# Altium schematic sheet System Control - Bank2.SchDoc
size C
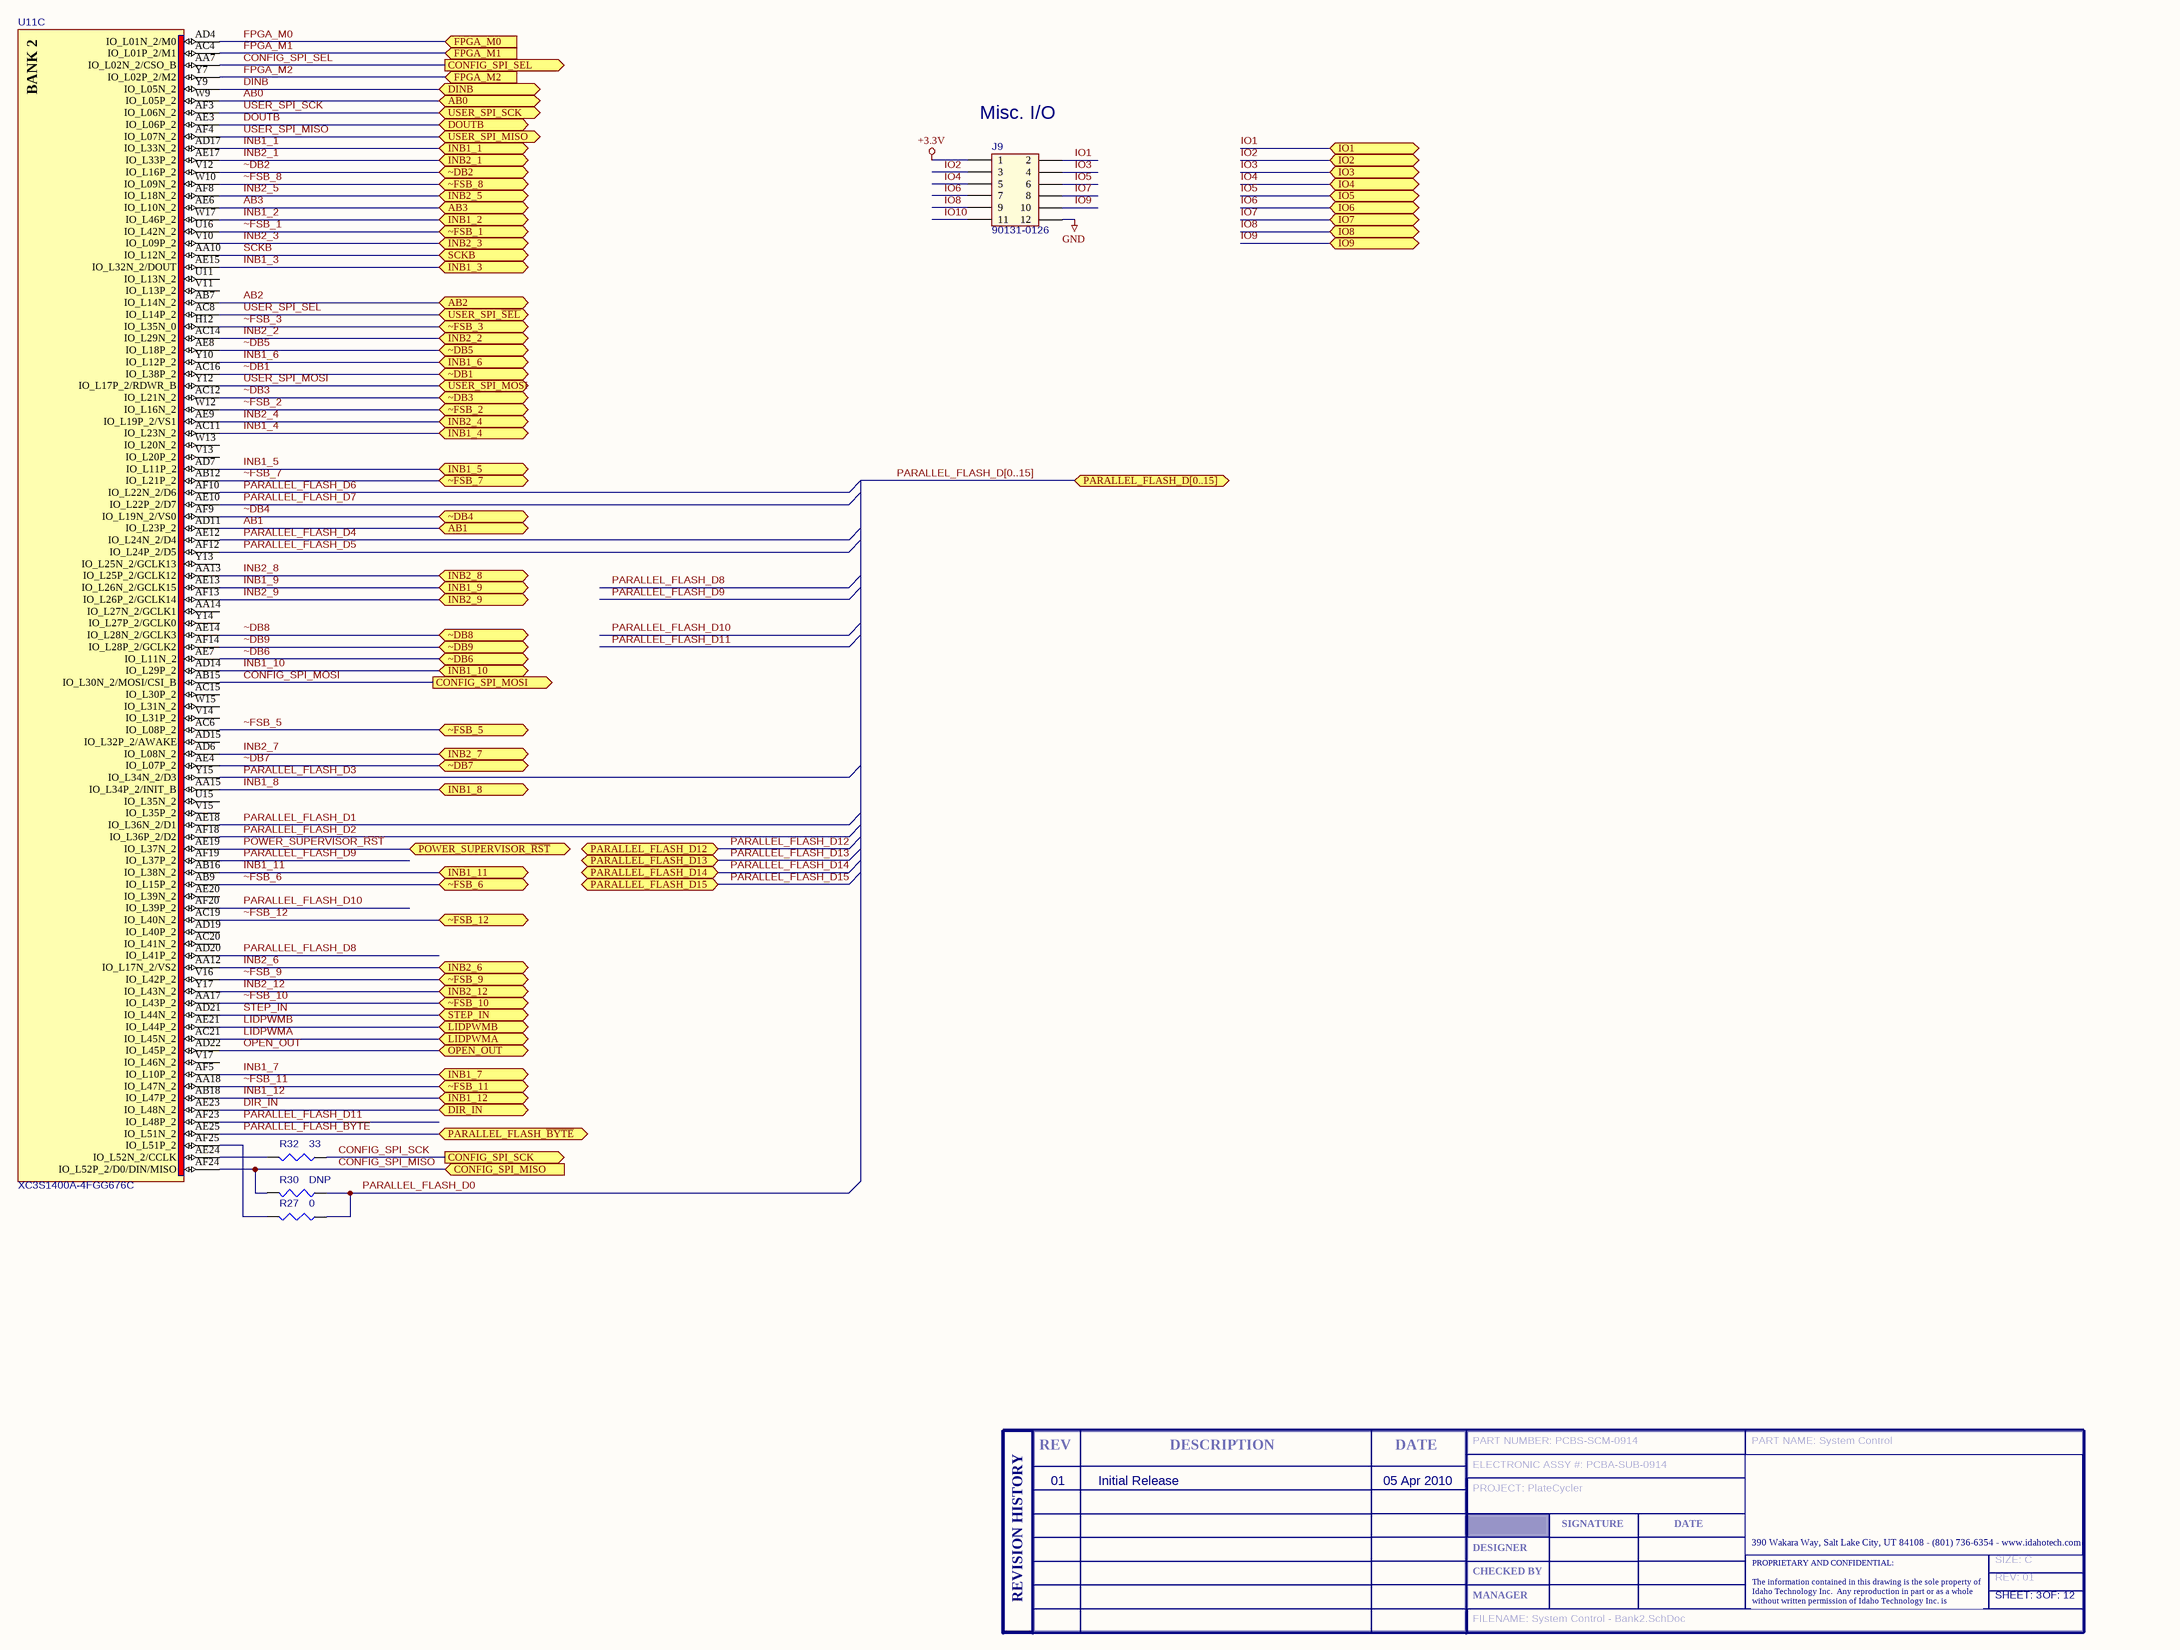
[diagram p0: System Control - Bank2.SchDoc]

## Parts
J9  Manufacturer P/N: 90131-0126  [HEADER_2X6_2]  (hidden comment: HEADER_2X6_1)
R27  0  [SM/R_0603]
R30  DNP  [SM/R_0603]  (no BOM)
R32  33  [SM/R_0603]
T?  SIZE: C  REV: 01  FILENAME: System Control - Bank2.SchDoc  PART NUMBER: PCBS-SCM-0914  PART NAME: System Control  ELECTRONIC ASSY #: PCBA-SUB-0914  PROJECT: PlateCycler  SHEET: 3  OF: 12  (hidden comment: ITI Title Block, A Size)  (graphical)
U11  XC3S1400A-4FGG676C  [FGG676]  (part C of 9)

## Ports
AB0, AB1, AB2, AB3, CONFIG_SPI_MISO (in), CONFIG_SPI_MOSI (out), CONFIG_SPI_SCK (out), CONFIG_SPI_SEL (out), DINB, DIR_IN, DOUTB, FPGA_M0 (in), FPGA_M1 (in), FPGA_M2 (in), INB1_1, INB1_2, INB1_3, INB1_4, INB1_5, INB1_6, INB1_7, INB1_8, INB1_9, INB1_10, INB1_11, INB1_12, INB2_1, INB2_2, INB2_3, INB2_4, INB2_5, INB2_6, INB2_7, INB2_8, INB2_9, INB2_12, IO1, IO2, IO3, IO4, IO5, IO6, IO7, IO8, IO9, LIDPWMA, LIDPWMB, OPEN_OUT, PARALLEL_FLASH_D12, PARALLEL_FLASH_D13, PARALLEL_FLASH_D14, PARALLEL_FLASH_D15, PARALLEL_FLASH_D[0..15] (bidir), PARALLEL_FLASH_~{BYTE}, POWER_SUPERVISOR_~{RST}, SCKB, STEP_IN, USER_SPI_MISO, USER_SPI_MOSI, USER_SPI_SCK, USER_SPI_~{SEL}, ~DB1, ~DB2, ~DB3, ~DB4, ~DB5, ~DB6, ~DB7, ~DB8, ~DB9, ~FSB_1, ~FSB_2, ~FSB_3, ~FSB_5, ~FSB_6, ~FSB_7, ~FSB_8, ~FSB_9, ~FSB_10, ~FSB_11, ~FSB_12

## Nets
+3.3V: J9.1
GND: J9.12
AB0: U11.W9(IO_L05P_2) ; port AB0
AB1: U11.AD11(IO_L23P_2) ; port AB1
AB2: U11.AB7(IO_L14N_2) ; port AB2
AB3: U11.AE6(IO_L10N_2) ; port AB3
CONFIG_SPI_MISO: R30.2 U11.AF24(IO_L52P_2/D0/DIN/MISO) ; port CONFIG_SPI_MISO
CONFIG_SPI_MOSI: U11.AB15(IO_L30N_2/MOSI/CSI_B) ; port CONFIG_SPI_MOSI
CONFIG_SPI_SCK: R32.1 ; port CONFIG_SPI_SCK
CONFIG_SPI_SEL: U11.AA7(IO_L02N_2/CSO_B) ; port CONFIG_SPI_SEL
DINB: U11.Y9(IO_L05N_2) ; port DINB
DIR_IN: U11.AE23(IO_L48N_2) ; port DIR_IN
DOUTB: U11.AE3(IO_L06P_2) ; port DOUTB
FPGA_M0: U11.AD4(IO_L01N_2/M0) ; port FPGA_M0
FPGA_M1: U11.AC4(IO_L01P_2/M1) ; port FPGA_M1
FPGA_M2: U11.Y7(IO_L02P_2/M2) ; port FPGA_M2
INB1_1: U11.AD17(IO_L33N_2) ; port INB1_1
INB1_2: U11.W17(IO_L46P_2) ; port INB1_2
INB1_3: U11.AE15(IO_L32N_2/DOUT) ; port INB1_3
INB1_4: U11.AC11(IO_L23N_2) ; port INB1_4
INB1_5: U11.AD7(IO_L11P_2) ; port INB1_5
INB1_6: U11.Y10(IO_L12P_2) ; port INB1_6
INB1_7: U11.AF5(IO_L10P_2) ; port INB1_7
INB1_8: U11.AA15(IO_L34P_2/INIT_B) ; port INB1_8
INB1_9: U11.AE13(IO_L26N_2/GCLK15) ; port INB1_9
INB1_10: U11.AD14(IO_L29P_2) ; port INB1_10
INB1_11: U11.AB16(IO_L38N_2) ; port INB1_11
INB1_12: U11.AB18(IO_L47P_2) ; port INB1_12
INB2_1: U11.AE17(IO_L33P_2) ; port INB2_1
INB2_2: U11.AC14(IO_L29N_2) ; port INB2_2
INB2_3: U11.V10(IO_L09P_2) ; port INB2_3
INB2_4: U11.AE9(IO_L19P_2/VS1) ; port INB2_4
INB2_5: U11.AF8(IO_L18N_2) ; port INB2_5
INB2_6: U11.AA12(IO_L17N_2/VS2) ; port INB2_6
INB2_7: U11.AD6(IO_L08N_2) ; port INB2_7
INB2_8: U11.AA13(IO_L25P_2/GCLK12) ; port INB2_8
INB2_9: U11.AF13(IO_L26P_2/GCLK14) ; port INB2_9
INB2_12: U11.Y17(IO_L43N_2) ; port INB2_12
IO1: J9.2 ; port IO1
IO2: J9.3 ; port IO2
IO3: J9.4 ; port IO3
IO4: J9.5 ; port IO4
IO5: J9.6 ; port IO5
IO6: J9.7 ; port IO6
IO7: J9.8 ; port IO7
IO8: J9.9 ; port IO8
IO9: J9.10 ; port IO9
IO10: J9.11
LIDPWMA: U11.AC21(IO_L45N_2) ; port LIDPWMA
LIDPWMB: U11.AE21(IO_L44P_2) ; port LIDPWMB
OPEN_OUT: U11.AD22(IO_L45P_2) ; port OPEN_OUT
PARALLEL_FLASH_~{BYTE}: U11.AE25(IO_L51N_2) ; port PARALLEL_FLASH_~{BYTE}
PARALLEL_FLASH_D0: R27.1 R30.1
PARALLEL_FLASH_D1: U11.AE18(IO_L36N_2/D1)
PARALLEL_FLASH_D2: U11.AF18(IO_L36P_2/D2)
PARALLEL_FLASH_D3: U11.Y15(IO_L34N_2/D3)
PARALLEL_FLASH_D4: U11.AE12(IO_L24N_2/D4)
PARALLEL_FLASH_D5: U11.AF12(IO_L24P_2/D5)
PARALLEL_FLASH_D6: U11.AF10(IO_L22N_2/D6)
PARALLEL_FLASH_D7: U11.AE10(IO_L22P_2/D7)
PARALLEL_FLASH_D8: U11.AD20(IO_L41P_2)
PARALLEL_FLASH_D9: U11.AF19(IO_L37P_2)
PARALLEL_FLASH_D10: U11.AF20(IO_L39P_2)
PARALLEL_FLASH_D11: U11.AF23(IO_L48P_2)
PARALLEL_FLASH_D12: port PARALLEL_FLASH_D12
PARALLEL_FLASH_D13: port PARALLEL_FLASH_D13
PARALLEL_FLASH_D14: port PARALLEL_FLASH_D14
PARALLEL_FLASH_D15: port PARALLEL_FLASH_D15
POWER_SUPERVISOR_~{RST}: U11.AE19(IO_L37N_2) ; port POWER_SUPERVISOR_~{RST}
SCKB: U11.AA10(IO_L12N_2) ; port SCKB
STEP_IN: U11.AD21(IO_L44N_2) ; port STEP_IN
USER_SPI_MISO: U11.AF4(IO_L07N_2) ; port USER_SPI_MISO
USER_SPI_MOSI: U11.Y12(IO_L17P_2/RDWR_B) ; port USER_SPI_MOSI
USER_SPI_~{SEL}: U11.AC8(IO_L14P_2) ; port USER_SPI_~{SEL}
USER_SPI_SCK: U11.AF3(IO_L06N_2) ; port USER_SPI_SCK
~DB1: U11.AC16(IO_L38P_2) ; port ~DB1
~DB2: U11.V12(IO_L16P_2) ; port ~DB2
~DB3: U11.AC12(IO_L21N_2) ; port ~DB3
~DB4: U11.AF9(IO_L19N_2/VS0) ; port ~DB4
~DB5: U11.AE8(IO_L18P_2) ; port ~DB5
~DB6: U11.AE7(IO_L11N_2) ; port ~DB6
~DB7: U11.AE4(IO_L07P_2) ; port ~DB7
~DB8: U11.AE14(IO_L28N_2/GCLK3) ; port ~DB8
~DB9: U11.AF14(IO_L28P_2/GCLK2) ; port ~DB9
~FSB_1: U11.U16(IO_L42N_2) ; port ~FSB_1
~FSB_2: U11.W12(IO_L16N_2) ; port ~FSB_2
~FSB_3: U11.H12(IO_L35N_0) ; port ~FSB_3
~FSB_5: U11.AC6(IO_L08P_2) ; port ~FSB_5
~FSB_6: U11.AB9(IO_L15P_2) ; port ~FSB_6
~FSB_7: U11.AB12(IO_L21P_2) ; port ~FSB_7
~FSB_8: U11.W10(IO_L09N_2) ; port ~FSB_8
~FSB_9: U11.V16(IO_L42P_2) ; port ~FSB_9
~FSB_10: U11.AA17(IO_L43P_2) ; port ~FSB_10
~FSB_11: U11.AA18(IO_L47N_2) ; port ~FSB_11
~FSB_12: U11.AC19(IO_L40N_2) ; port ~FSB_12
NetR27_2: R27.2 U11.AF25(IO_L51P_2)
NetR32_2: R32.2 U11.AE24(IO_L52N_2/CCLK)

Not connected (* = marked no-connect by the designer): U11 AA14(IO_L27N_2/GCLK1) AC15(IO_L30P_2) AC20(IO_L41N_2) AD15(IO_L32P_2/AWAKE) AD19(IO_L40P_2) AE20(IO_L39N_2) U11(IO_L13N_2) U15(IO_L35N_2) V11(IO_L13P_2) V13(IO_L20P_2) V14(IO_L31P_2) V15(IO_L35P_2) V17(IO_L46N_2) W13(IO_L20N_2) W15(IO_L31N_2) Y13(IO_L25N_2/GCLK13) Y14(IO_L27P_2/GCLK0)

## Buses and harness runs
bus PARALLEL_FLASH_D[0..15] = port PARALLEL_FLASH_D[0..15]

## Notes on the sheet
- (near J9) Misc. I/O
- 01
- Initial Release
- 05 Apr 2010
- (in symbol ITI A-size Title Block and Rev Table) REV; DESCRIPTION; DATE; SIGNATURE; 390 Wakara Way, Salt Lake City, UT 84108 - (801) 736-6354 - www.idahotech.com; DESIGNER; CHECKED BY; REVISION HISTORY; MANAGER; PROPRIETARY AND CONFIDENTIAL: / The information contained in this drawing is the sole property of / Idaho Technology Inc.  Any reproduction in part or as a whole / without written permission of Idaho Technology Inc. is prohibited.
- (in symbol XC3S1400A-4FGG676C, part C) BANK 2

## Library data of the parts
J9 = HEADER_2X6_1: CONN HEADER 12POS .100" STR TIN; Manufacturer: MOLEX; Vendor: DIGIKEY; Vendor P/N: WM8124-ND; Desc: CONN HEADER 12POS .100" STR TIN; Price: 1.28
R27 R30 = R0 5% 0603: RES ZERO OHM 1/10W 5% 0603 SMD; Manufacturer: Panasonic; Manufacturer P/N: ERJ-3GEY0R00V; Vendor: Digikey; Vendor P/N: P0.0GCT-ND
R32 = R10K 5% 0603: RES 33 OHM 1/10W 5% 0603 SMD; Manufacturer: Panasonic; Manufacturer P/N: ERJ-3GEYJ330V; Vendor: Digikey; Vendor P/N: P33GCT-ND
T? = ITI A-size Title Block and Rev Table: ITI Title Block and Rev Table, A Size
U11 = XC3S1400A-4FGG676C: Spartan-3A  I/O Optimized FPGA, 502 User I/Os, 676-Pin Pb-Free FBGA, Standard Performance, Commercial Grade; Published: 12-Dec-2006; DatasheetVersion: 08-May-2007; PackageVersion: ver1.2.1, Apr-2005; PackageReference: FGG676; Publisher: Altium Limited; PackageDescription: 676-Ball Fine Pitch Ball Grid Array (FGG676) - Pb-Free; Code_JEDEC: MS-034-AAL-1; Code_IPC: BGA100P26X26-676; ComponentLink1Description: Manufacturer Link; ComponentLink1URL: http://www.xilinx.com/products/silicon_solutions/fpgas/spartan_series/spartan3a_fpgas/index.htm; ComponentLink2Description: Datasheet; ComponentLink2URL: http://direct.xilinx.com/bvdocs/publications/ds529.pdf